# EAGLE design Locomotion_Breakout (EAGLE 7.6.0)
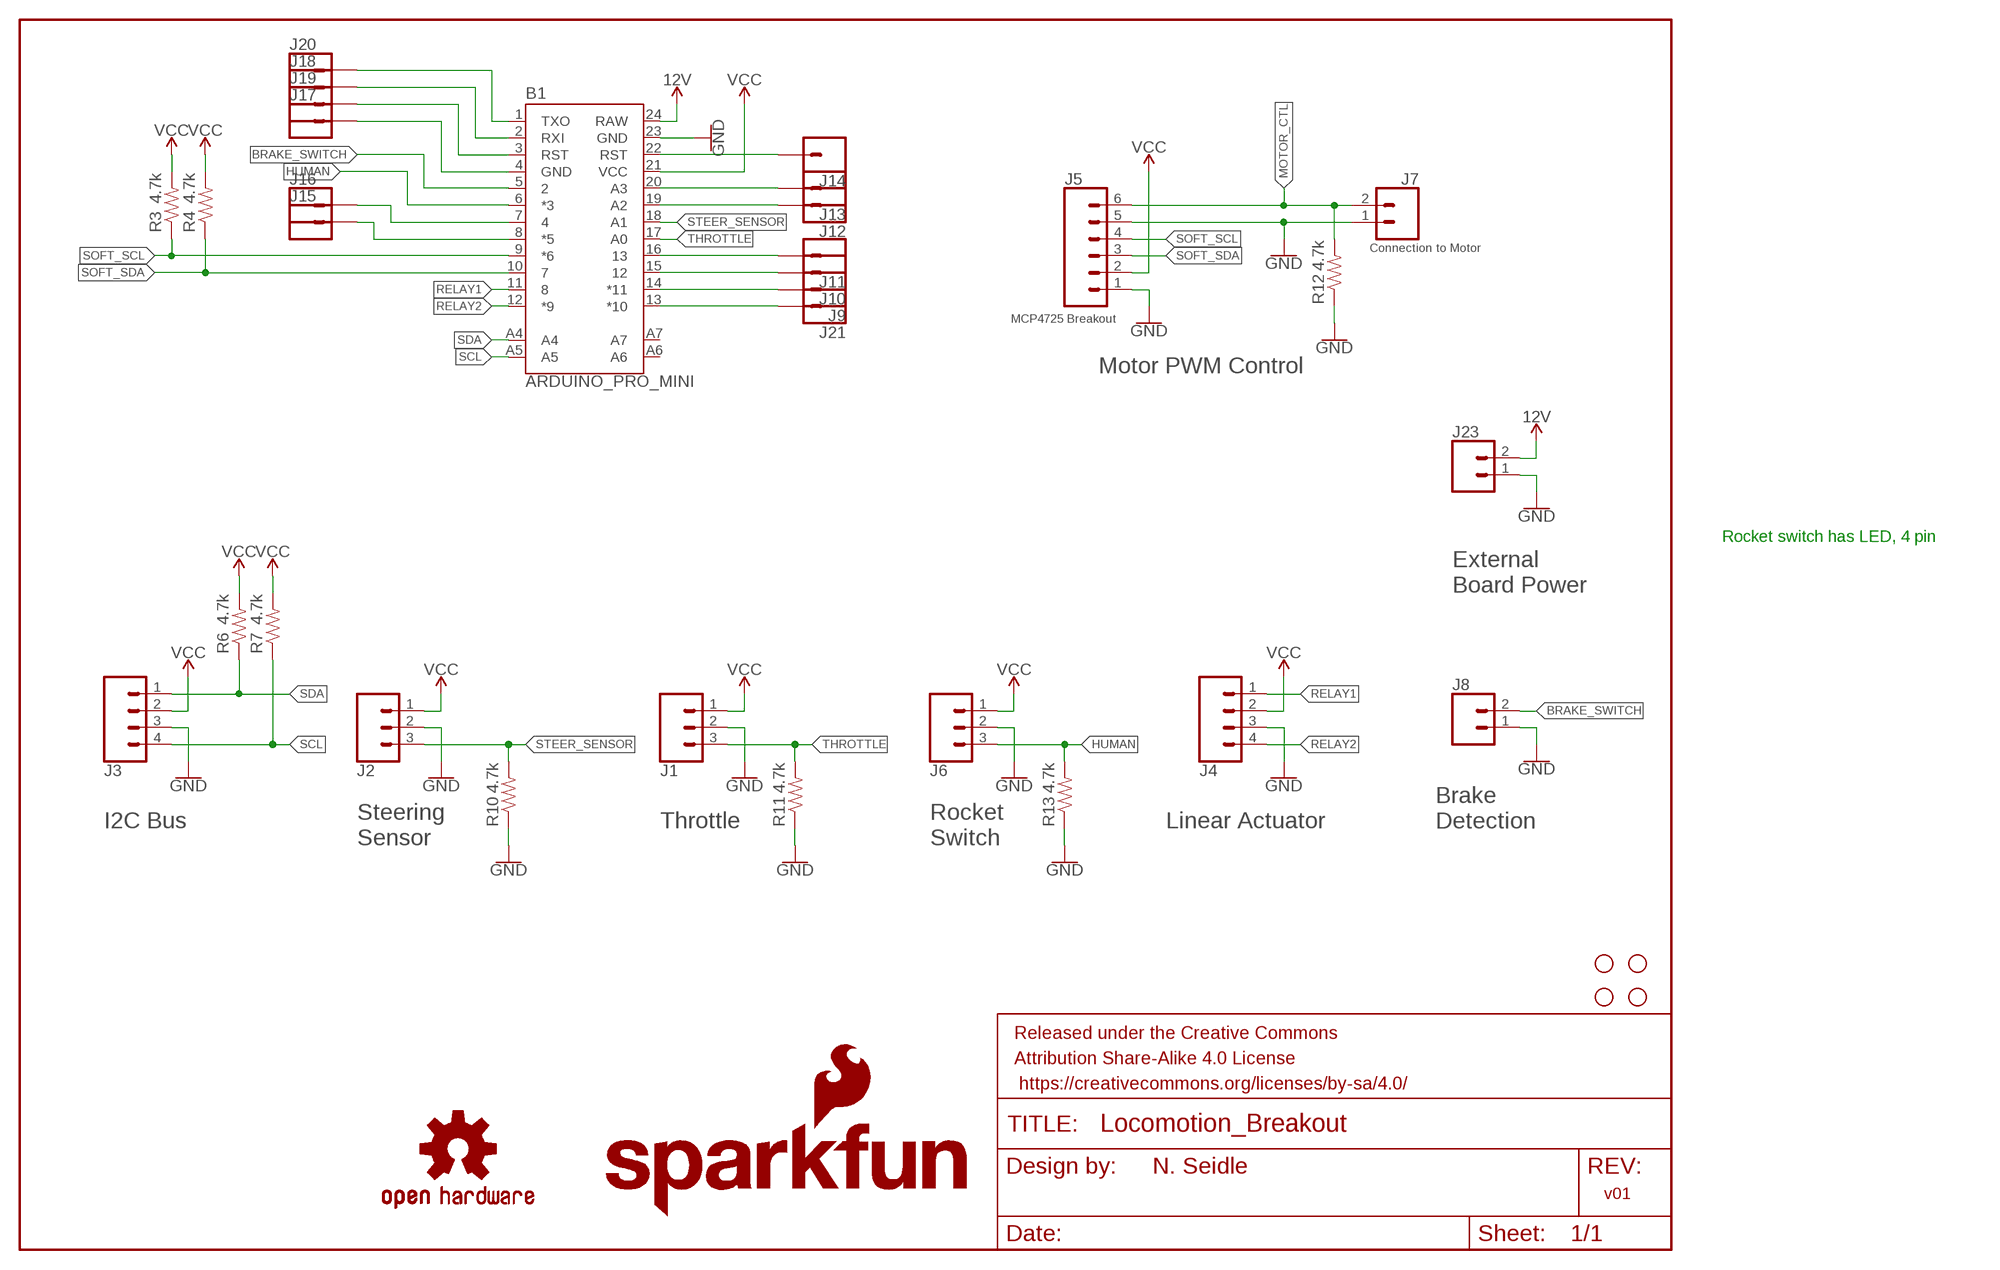
[diagram p0: schematic, sheet 1]

## Parts
B1  ARDUINO_PRO_MINI  [ARDUINO_PRO_MINI]
FRAME1  FRAME-LETTER  [CREATIVE_COMMONS]
J1  CONN_03JST-PTH-VERT  [JST-3-PTH-VERT]
J2  CONN_03JST-PTH-VERT  [JST-3-PTH-VERT]
J3  CONN_04JST-PTH-VERT  [JST-4-PTH-VERT]
J4  CONN_04JST-PTH-VERT  [JST-4-PTH-VERT]
J5  CONN_06SILK_FEMALE_PTH  [1X06]
J6  CONN_03JST-PTH-VERT  [JST-3-PTH-VERT]
J7  CONN_02JST-PTH-VERT  [JST-2-PTH-VERT]
J8  CONN_02JST-PTH-VERT  [JST-2-PTH-VERT]
J9  CONN_01PTH_NO_SILK_YES_STOP  [1X01_NO_SILK]
J10  CONN_01PTH_NO_SILK_YES_STOP  [1X01_NO_SILK]
J11  CONN_01PTH_NO_SILK_YES_STOP  [1X01_NO_SILK]
J12  CONN_01PTH_NO_SILK_YES_STOP  [1X01_NO_SILK]
J13  CONN_01PTH_NO_SILK_YES_STOP  [1X01_NO_SILK]
J14  CONN_01PTH_NO_SILK_YES_STOP  [1X01_NO_SILK]
J15  CONN_01PTH_NO_SILK_YES_STOP  [1X01_NO_SILK]
J16  CONN_01PTH_NO_SILK_YES_STOP  [1X01_NO_SILK]
J17  CONN_01PTH_NO_SILK_YES_STOP  [1X01_NO_SILK]
J18  CONN_01PTH_NO_SILK_YES_STOP  [1X01_NO_SILK]
J19  CONN_01PTH_NO_SILK_YES_STOP  [1X01_NO_SILK]
J20  CONN_01PTH_NO_SILK_YES_STOP  [1X01_NO_SILK]
J21  CONN_01PTH_NO_SILK_YES_STOP  [1X01_NO_SILK]
J23  CONN_02JST-PTH-VERT  [JST-2-PTH-VERT]
LOGO1  SFE_LOGO_FLAME.1_INCH  [SFE_LOGO_FLAME_.1]
LOGO2  OSHW-LOGOS  [OSHW-LOGO-S]
LOGO3  SFE_LOGO_NAME.1_INCH  [SFE_LOGO_NAME_.1]
R3  4.7k  1KOHM-HORIZ-1/4W-5%  [AXIAL-0.3]
R4  4.7k  1KOHM-HORIZ-1/4W-5%  [AXIAL-0.3]
R6  4.7k  1KOHM-HORIZ-1/4W-5%  [AXIAL-0.3]
R7  4.7k  1KOHM-HORIZ-1/4W-5%  [AXIAL-0.3]
R10  4.7k  1KOHM-HORIZ-1/4W-5%  [AXIAL-0.3]
R11  4.7k  1KOHM-HORIZ-1/4W-5%  [AXIAL-0.3]
R12  4.7k  1KOHM-HORIZ-1/4W-5%  [AXIAL-0.3]
R13  4.7k  1KOHM-HORIZ-1/4W-5%  [AXIAL-0.3]
STANDOFF1  STAND-OFF  [STAND-OFF]
STANDOFF2  STAND-OFF  [STAND-OFF]
STANDOFF3  STAND-OFF  [STAND-OFF]
STANDOFF4  STAND-OFF  [STAND-OFF]

## Nets
12V: B1.24(RAW) J23.2
BRAKE_SWITCH: B1.5 J8.2
GND [power]: B1.23(GND) J1.2 J2.2 J3.3 J4.3 J5.1 J5.5 J6.2 J7.1 J8.1 J23.1 R10.P$1 R11.P$1 R12.P$1 R13.P$1
HUMAN: B1.6(*3) J6.3 R13.P$2
MOTOR_CTL: J5.6 J7.2 R12.P$2
N$1: B1.2(RXI) J18.1
N$2: B1.3(RST) J19.1
N$3: B1.4(GND) J17.1
N$4: B1.7 J16.1
N$5: B1.8(*5) J15.1
N$6: B1.13(*10) J21.1
N$7: B1.14(*11) J9.1
N$8: B1.15 J10.1
N$9: B1.16 J11.1
N$10: B1.19(A2) J12.1
N$11: B1.20(A3) J13.1
N$13: B1.22(RST) J14.1
N$14: B1.1(TXO) J20.1
RELAY1: B1.11 J4.1
RELAY2: B1.12(*9) J4.4
SCL: B1.A5 J3.4 R7.P$1
SDA: B1.A4 J3.1 R6.P$1
SOFT_SCL: B1.9(*6) J5.4 R3.P$1
SOFT_SDA: B1.10 J5.3 R4.P$1
STEER_SENSOR: B1.18(A1) J2.3 R10.P$2
THROTTLE: B1.17(A0) J1.3 R11.P$2
VCC: B1.21(VCC) J1.1 J2.1 J3.2 J4.2 J5.2 J6.1 R3.P$2 R4.P$2 R6.P$2 R7.P$2
Unconnected: B1.A6 B1.A7

## Notes on the sheet
- Connection to Motor
- MCP4725 Breakout
- Motor PWM Control
- Rocket switch has LED, 4 pin
- External
  Board Power
- I2C Bus | Throttle | Linear Actuator
- Brake
  Detection
- Steering
  Sensor
- Rocket
  Switch
- N. Seidle
- v01

## Library data of the parts
B1 = SparkFun-Boards:ARDUINO_PRO_MINI: SparkFun Pro Mini Pro Mini compatible footprint. Dimensions: 0.7 x 1.3" PCB Thickness: 0.8mm SparkFun Products: 3.3V/8MHz <https://www.sparkfun.com/products/11114> 5V/16MHz <https://www.sparkfun.com/products/11113>
FRAME1 = SparkFun-Aesthetics:FRAME-LETTER: Schematic Frame Standard 8.5x11 US Letter frame
J1 J2 J6 = SparkFun-Connectors:CONN_03: Multi connection point. Often used as Generic Header-pin footprint for 0.1 inch spaced/style header connections On any of the 0.1 inch spaced packages, you can populate with these: Break Away Headers - Straight <https://www.sparkfun.com/products/116> (PRT-00116) Break Away Male Headers - Right Angle <https://www.sparkfun.com/products/553> (PRT-00553) Female Headers <https://www.sparkfun.com/products/115> (PRT-00115) Break Away Headers - Machine Pin <https://www.sparkfun.com/products/117> (PRT-00117) Break Away Female Headers - Swiss Machine Pin <https://www.sparkfun.com/products/743> (PRT-00743) Stackable Header - 3 Pin (Female, 0.1") <https://www.sparkfun.com/products/13875> (PRT-13875) For SCREWTERMINALS and SPRING TERMINALS visit here: Screw Terimnals on SparkFun.com <https://www.sparkfun.com/search/results?term=Screw+Terminals> (5mm/3.5mm/2.54mm spacing) This device is also useful as a general connection point to wire up your design to another part of your project. Our various solder wires solder well into these plated through hole pads. Hook-Up Wire - Assortment (Stranded, 22 AWG) <https://www.sparkfun.com/products/11375> (PRT-11375) Hook-Up Wire - Assortment (Solid Core, 22 AWG) <https://www.sparkfun.com/products/11367> (PRT-11367) View the entire wire category on our website here <https://www.sparkfun.com/categories/141> Special notes: Molex polarized connector foot print use with SKU : PRT-08232 with associated crimp pins and housings.
J3 J4 = SparkFun-Connectors:CONN_04: Multi connection point. Often used as Generic Header-pin footprint for 0.1 inch spaced/style header connections On any of the 0.1 inch spaced packages, you can populate with these: Break Away Headers - Straight <https://www.sparkfun.com/products/116> (PRT-00116) Break Away Male Headers - Right Angle <https://www.sparkfun.com/products/553> (PRT-00553) Female Headers <https://www.sparkfun.com/products/115> (PRT-00115) Break Away Headers - Machine Pin <https://www.sparkfun.com/products/117> (PRT-00117) Break Away Female Headers - Swiss Machine Pin <https://www.sparkfun.com/products/743> (PRT-00743) For SCREWTERMINALS and SPRING TERMINALS visit here: Screw Terimnals on SparkFun.com <https://www.sparkfun.com/search/results?term=Screw+Terminals> (5mm/3.5mm/2.54mm spacing) This device is also useful as a general connection point to wire up your design to another part of your project. Our various solder wires solder well into these plated through hole pads. Hook-Up Wire - Assortment (Stranded, 22 AWG) <https://www.sparkfun.com/products/11375> (PRT-11375) Hook-Up Wire - Assortment (Solid Core, 22 AWG) <https://www.sparkfun.com/products/11367> (PRT-11367) View the entire wire category on our website here <https://www.sparkfun.com/categories/141> Special notes: Molex polarized connector foot print use with SKU : PRT-08231 with associated crimp pins and housings. 1MM SMD Version SKU: PRT-10208; PROD_ID: CONN-13251
J5 = SparkFun-Connectors:CONN_06: Multi connection point. Often used as Generic Header-pin footprint for 0.1 inch spaced/style header connections On any of the 0.1 inch spaced packages, you can populate with these: Break Away Headers - Straight <https://www.sparkfun.com/products/116> (PRT-00116) Break Away Male Headers - Right Angle <https://www.sparkfun.com/products/553> (PRT-00553) Female Headers <https://www.sparkfun.com/products/115> (PRT-00115) Break Away Headers - Machine Pin <https://www.sparkfun.com/products/117> (PRT-00117) Break Away Female Headers - Swiss Machine Pin <https://www.sparkfun.com/products/743> (PRT-00743) Arduino Stackable Header - 6 Pin <https://www.sparkfun.com/products/9280> (PRT-09280) For SCREWTERMINALS and SPRING TERMINALS visit here: Screw Terimnals on SparkFun.com <https://www.sparkfun.com/search/results?term=Screw+Terminals> (5mm/3.5mm/2.54mm spacing) This device is also useful as a general connection point to wire up your design to another part of your project. Our various solder wires solder well into these plated through hole pads. Hook-Up Wire - Assortment (Stranded, 22 AWG) <https://www.sparkfun.com/products/11375> (PRT-11375) Hook-Up Wire - Assortment (Solid Core, 22 AWG) <https://www.sparkfun.com/products/11367> (PRT-11367) View the entire wire category on our website here <https://www.sparkfun.com/categories/141> Special notes: Molex polarized connector foot print use with SKU : PRT-08231 with associated crimp pins and housings. 1MM SMD Version SKU: PRT-10208 NOTES ON THE VARIANTS LOCK and LOCK_LONGPADS... This footprint was designed to help hold the alignment of a through-hole component (i.e. 6-pin header) while soldering it into place. You may notice that each hole has been shifted either up or down by 0.005 of an inch from it's more standard position (which is a perfectly straight line). This slight alteration caused the pins (the squares in the middle) to touch the edges of the holes. Because they are alternating, it causes a "brace" to hold the component in place. 0.005 has proven to be the perfect amount of "off-center" position when using our standard breakaway headers. Although looks a little odd when you look at the bare footprint, once you have a header in there, the alteration is very hard to notice. Also,if you push a header all the way into place, it is covered up entirely on the bottom side.; PROD_ID: CONN-08437
J7 J8 J23 = SparkFun-Connectors:CONN_02: Multi connection point. Often used as Generic Header-pin footprint for 0.1 inch spaced/style header connections On any of the 0.1 inch spaced packages, you can populate with these: Break Away Headers - Straight <https://www.sparkfun.com/products/116> (PRT-00116) Break Away Male Headers - Right Angle <https://www.sparkfun.com/products/553> (PRT-00553) Female Headers <https://www.sparkfun.com/products/115> (PRT-00115) Break Away Headers - Machine Pin <https://www.sparkfun.com/products/117> (PRT-00117) Break Away Female Headers - Swiss Machine Pin <https://www.sparkfun.com/products/743> (PRT-00743) For SCREWTERMINALS and SPRING TERMINALS visit here: Screw Terimnals on SparkFun.com <https://www.sparkfun.com/search/results?term=Screw+Terminals> (5mm/3.5mm/2.54mm spacing) This device is also useful as a general connection point to wire up your design to another part of your project. Our various solder wires solder well into these plated through hole pads. Hook-Up Wire - Assortment (Stranded, 22 AWG) <https://www.sparkfun.com/products/11375> (PRT-11375) Hook-Up Wire - Assortment (Solid Core, 22 AWG) <https://www.sparkfun.com/products/11367> (PRT-11367) View the entire wire category on our website here <https://www.sparkfun.com/categories/141> Special notes: Molex polarized connector foot print use with: PRT-08233 with associated crimp pins and housings. 2.54_SCREWTERM for use with PRT-10571. 3.5mm Screw Terminal footprints for PRT-08084 5mm Screw Terminal footprints for use with PRT-08432
J9-J21 = SparkFun-Connectors:CONN_01: Single connection point. Often used as Generic Header-pin footprint for 0.1 inch spaced/style header connections On any of the 0.1 inch spaced packages, you can populate with these: Break Away Headers - Straight <https://www.sparkfun.com/products/116> (PRT-00116) Break Away Male Headers - Right Angle <https://www.sparkfun.com/products/553> (PRT-00553) Female Headers <https://www.sparkfun.com/products/115> (PRT-00115) Break Away Headers - Machine Pin <https://www.sparkfun.com/products/117> (PRT-00117) Break Away Female Headers - Swiss Machine Pin <https://www.sparkfun.com/products/743> (PRT-00743) This device is also useful as a general connection point to wire up your design to another part of your project. Our various solder wires solder well into these plated through hole pads. Hook-Up Wire - Assortment (Stranded, 22 AWG) <https://www.sparkfun.com/products/11375> (PRT-11375) Hook-Up Wire - Assortment (Solid Core, 22 AWG) <https://www.sparkfun.com/products/11367> (PRT-11367) View the entire wire category on our website here <https://www.sparkfun.com/categories/141> Special notes: SMTSO-256-ET is a "flush mount" nut for a 4-40 screw. We mostly use this on specialty testbeds; it is a nice way to connect hardware to your PCB at an adjustable hieght. Also note, the SNAP packages are for using a snappable style connector. We sell a baggie of snaps and they are also used on two LilyPad designs: Snap Assortment - 30 pack (male and female) <https://www.sparkfun.com/products/11347> (DEV-11347) LilyPad Arduino SimpleSnap <https://www.sparkfun.com/products/10941> (DEV-10941) LilyPad SimpleSnap Protoboard <https://www.sparkfun.com/products/10940> (DEV-10940)
LOGO1 = SparkFun-Aesthetics:SFE_LOGO_FLAME: SparkFun Flame Logo This is the SparkFun flame logo. The logo on the schematic will always be the same size; the package variant is the height of the flame. Default layer for the logo on the board is tSilk.
LOGO2 = SparkFun-Aesthetics:OSHW-LOGO: Open Source Hardware Logo This logo indicates the piece of hardware it is found on incorporates a OSHW license and/or adheres to the definition of open source hardware found here: http://freedomdefined.org/OSHW
LOGO3 = SparkFun-Aesthetics:SFE_LOGO_NAME: SparkFun Font Logo This is the SparkFun name logo. The logo on the schematic will always be the same size; the package variant is the height of the flame part of the logo (or the height the flame would be, if it were drawn). Default layer for the logo on the board is tSilk.
R3 R4 R6 R7 R10-R13 = SparkFun-Resistors:1KOHM: 1kΩ resistor A resistor is a passive two-terminal electrical component that implements electrical resistance as a circuit element. Resistors act to reduce current flow, and, at the same time, act to lower voltage levels within circuits. - Wikipedia; PROD_ID: RES-08380; VALUE: 1k
STANDOFF1-STANDOFF4 = SparkFun-Electromechanical:STAND-OFF: #4 Stand Off This is the mechanical footprint for a #4 phillips button head screw. Use the keepout ring to avoid running the screw head into surrounding components. SKU : PRT-00447

## Net classes
1 power: width 0.203 mm

## Board
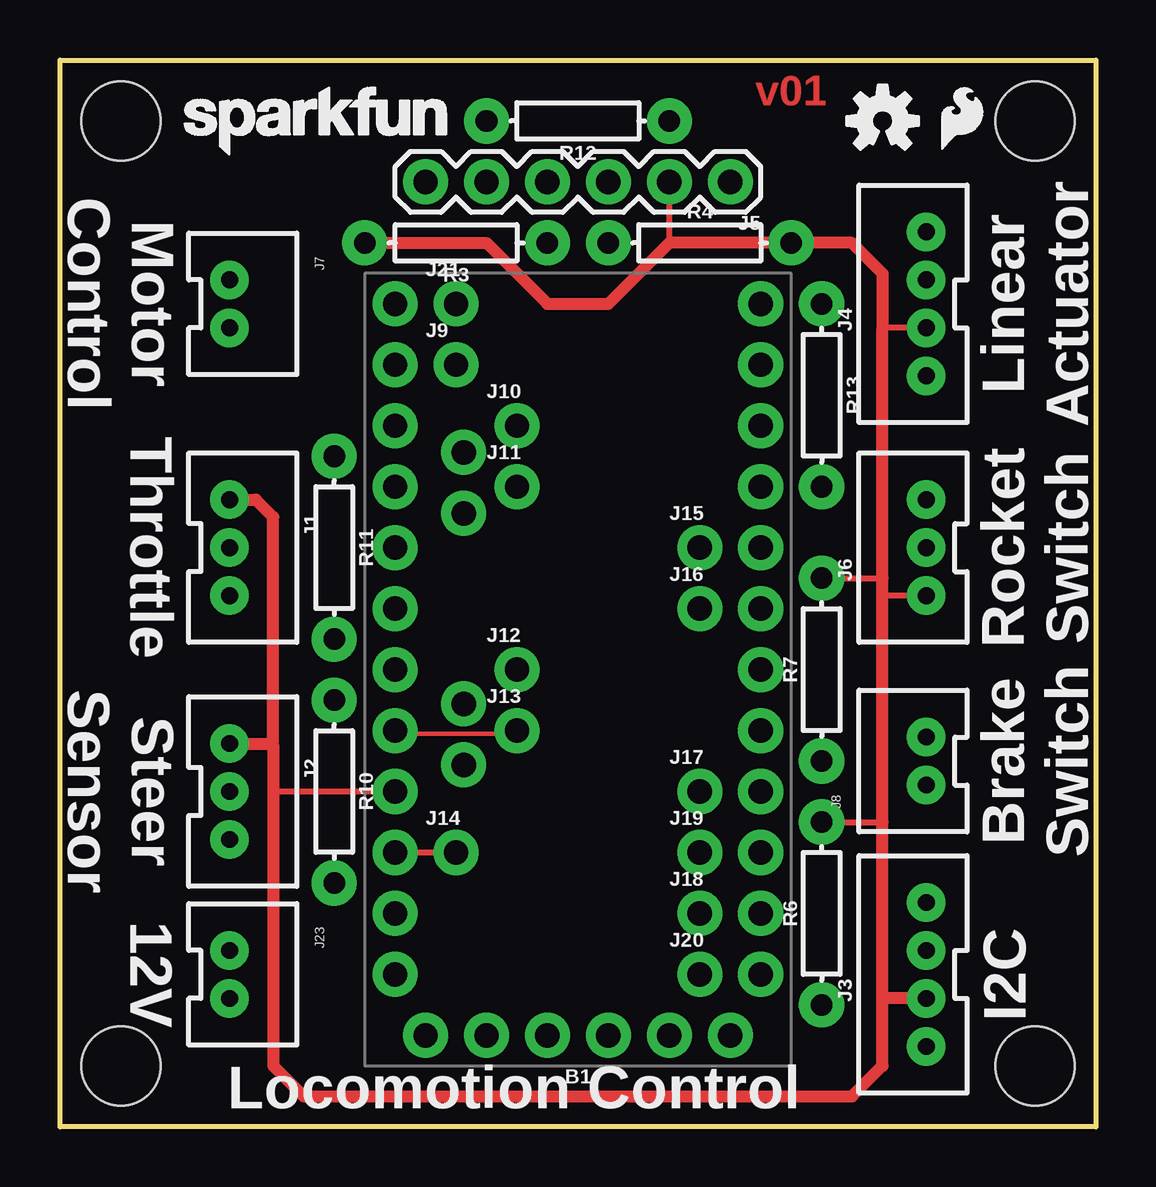
[diagram p1: board, top side]
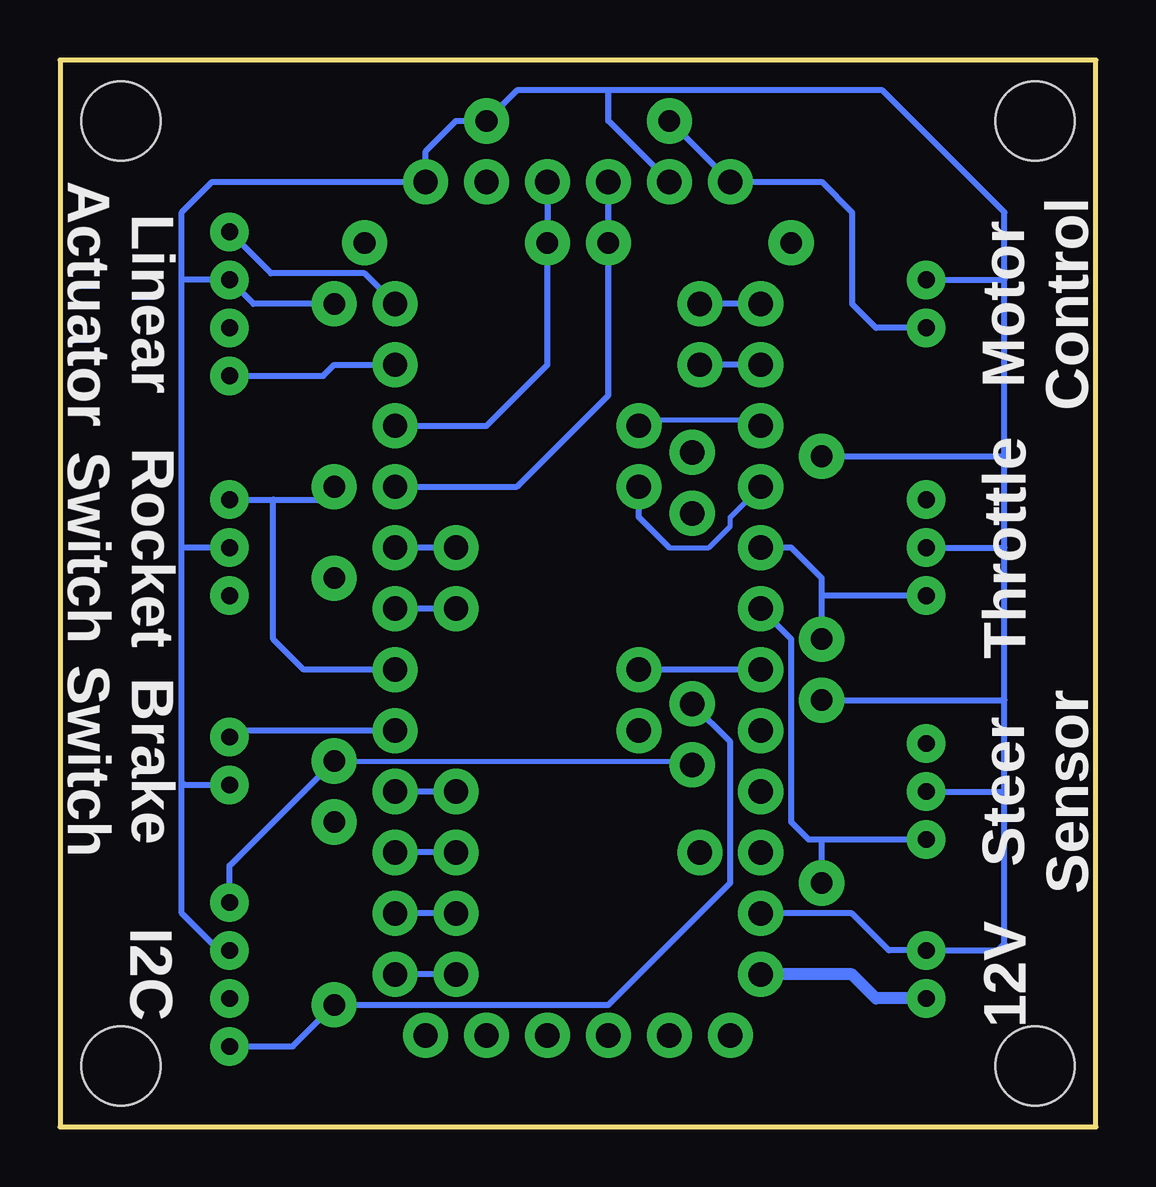
[diagram p2: board, bottom side, seen from below]

Size 43.18 x 44.45 mm. Coordinates in mm from the lower left corner, seen from the top.
Outline: 43.18,0 0,0 0,44.45 43.18,44.45 43.18,0
Copper layers (1*16): Top 0.035mm / dielectric 1.5mm / Bottom 0.035mm
Design rules "SparkFun-2-layer-TIGHT": minimum track width 7mil, minimum drill 15mil, track to track 7mil, track to pad 7mil, pad to pad 7mil, via to via 7mil, smd to smd 7mil, copper to edge 7mil, drill to drill 7mil, minimum pad ring 7mil, minimum via ring 7mil, stop-mask expansion 4mil, vias tented up to drill 20mil, thermal gap 10mil

### Footprints (pad centres in the part's own frame; a part is rotated, then mirrored left to right if it is on the bottom)
ARDUINO_PRO_MINI = drill 1.016 pad 1.88: 1 -7.62,12.7; 2 -7.62,10.16; 3 -7.62,7.62; 4 -7.62,5.08; 5 -7.62,2.54; 6 -7.62,0; 7 -7.62,-2.54; 8 -7.62,-5.08; 9 -7.62,-7.62; 10 -7.62,-10.16; 11 -7.62,-12.7; 12 -7.62,-15.24; 13 7.62,-15.24; 14 7.62,-12.7; 15 7.62,-10.16; 16 7.62,-7.62; 17 7.62,-5.08; 18 7.62,-2.54; 19 7.62,0; 20 7.62,2.54; 21 7.62,5.08; 22 7.62,7.62; 23 7.62,10.16; 24 7.62,12.7; A4 4.763,1.429; A5 4.763,3.969; A6 4.763,-9.049; A7 4.763,-6.509; BLK -6.35,15.24; GND -3.81,15.24; GRN 6.35,15.24; RXI 1.27,15.24; TXO 3.81,15.24; VCC -1.27,15.24
JST-3-PTH-VERT = drill 0.7 pad 1.6: 1 -2,-0.55; 2 0,-0.55; 3 2,-0.55
JST-4-PTH-VERT = drill 0.7 pad 1.6: 1 -3,-0.55; 2 -1,-0.55; 3 1,-0.55; 4 3,-0.55
1X06 = drill 1.016 pad 1.88: 1 0,0; 2 2.54,0; 3 5.08,0; 4 7.62,0; 5 10.16,0; 6 12.7,0
JST-2-PTH-VERT = drill 0.7 pad 1.6: 1 -1,-0.55; 2 1,-0.55
1X01_NO_SILK = drill 1.016 pad 1.88: 1 0,0
AXIAL-0.3 = drill 0.9 pad 1.88: P$1 -3.81,0; P$2 3.81,0
STAND-OFF = hole 3.302: 0,0

### Placement (x,y rotation side)
B1  21.59,19.05 180 top
FRAME1  -2.54,-16.51 0 top  (outside the outline)
J1  7.62,24.13 270 top
J2  7.62,13.97 270 top
J3  35.56,6.35 90 top
J4  35.56,34.29 90 top
J5  27.94,39.37 180 top
J6  35.56,24.13 90 top
J7  7.62,34.29 270 top
J8  35.56,15.24 90 top
J9  16.51,31.75 0 top
J10  19.05,29.21 0 top
J11  19.05,26.67 0 top
J12  19.05,19.05 0 top
J13  19.05,16.51 0 top
J14  16.51,11.43 0 top
J15  26.67,24.13 0 top
J16  26.67,21.59 0 top
J17  26.67,13.97 0 top
J18  26.67,8.89 0 top
J19  26.67,11.43 0 top
J20  26.67,6.35 0 top
J21  16.51,34.29 0 top
J23  7.62,6.35 270 top
LOGO1  36.45,40.39 0 top
LOGO2  34.29,41.91 0 top
LOGO3  4.7,40.01 0 top
R3  16.51,36.83 180 top
R4  26.67,36.83 0 top
R6  31.75,8.89 90 top
R7  31.75,19.05 90 top
R10  11.43,13.97 270 top
R11  11.43,24.13 270 top
R12  21.59,41.91 180 top
R13  31.75,30.48 270 top
STANDOFF1  2.54,2.54 0 top
STANDOFF2  2.54,41.91 0 top
STANDOFF3  40.64,41.91 0 top
STANDOFF4  40.64,2.54 0 top

### Tracks (layer width: path | path; a pad name or v marks a point on that pad's centre or on a via)
12V
  Bottom 0.508: J23.2 9.16,5.35 10.16,6.35 B1.24
BRAKE_SWITCH
  Bottom 0.254: B1.5 35.84,16.51 J8.2
GND
  Bottom 0.254: J3.3 36.56,7.35 38.1,8.89 38.1,14.35 | 38.1,14.35 38.1,24.13 | 38.1,24.13 38.1,35.31 | 38.1,35.31 38.1,38.1 36.83,39.37 J5.1 27.94,40.64 26.67,41.91 R12.P$1 24.13,43.18 20.32,43.18 | R13.P$1 35.11,34.29 J4.3 38.08,35.29 38.1,35.31 | J8.1 37.99,14.24 38.1,14.35 | 3.81,13.97 3.81,7.62 4.08,7.35 J23.1 8.62,7.35 10.16,8.89 B1.23 | 3.81,13.97 3.81,17.78 | 3.81,17.78 3.81,24.13 | 3.81,24.13 3.81,27.94 | 3.81,27.94 3.81,35.31 | 3.81,35.31 3.81,38.1 8.89,43.18 20.32,43.18 | R11.P$1 3.81,27.94 | J1.2 3.81,24.13 | R10.P$1 3.81,17.78 | J2.2 3.81,13.97 | J6.2 38.1,24.13 | J7.1 3.83,35.29 3.81,35.31 | J5.5 20.32,41.91 20.32,43.18
HUMAN
  Bottom 0.254: B1.6 33.02,19.05 34.29,20.32 34.29,26.13 | J6.3 34.29,26.13 | 34.29,26.13 32.29,26.13 R13.P$2
MOTOR_CTL
  Bottom 0.254: R12.P$2 J5.6 11.43,39.37 10.16,38.1 10.16,34.29 9.16,33.29 J7.2
N$1
  Bottom 0.254: J18.1 B1.2
N$2
  Bottom 0.254: J19.1 B1.3
N$3
  Bottom 0.254: J17.1 B1.4
N$4
  Bottom 0.254: J16.1 B1.7
N$5
  Bottom 0.254: J15.1 B1.8
N$6
  Bottom 0.254: B1.13 J21.1
N$7
  Bottom 0.254: B1.14 J9.1
N$8
  Bottom 0.203: 18.8,29.46 14.22,29.46 B1.15
  Bottom 0.254: 18.8,29.46 J10.1
N$9
  Bottom 0.203: 17.78,24.13 16.13,24.13 15.24,25.02 15.24,25.4 B1.16
  Bottom 0.254: 17.78,24.13 19.05,25.4 J11.1
N$10
  Bottom 0.254: B1.19 J12.1
N$11
  Top 0.178: 18.92,16.38 14.1,16.38 B1.20
  Top 0.254: 18.92,16.38 J13.1
N$13
  Top 0.254: B1.22 J14.1
N$14
  Bottom 0.254: J20.1 B1.1
RELAY1
  Bottom 0.254: J4.1 32.21,31.29 31.75,31.75 B1.11
RELAY2
  Bottom 0.254: B1.12 30.48,35.56 34.38,35.56 J4.4
SCL
  Bottom 0.203: R7.P$1 16.99,15.24 B1.A5
  Bottom 0.254: R7.P$1 36.11,10.88 J3.4
SDA
  Bottom 0.254: J3.1 33.48,3.35 R6.P$1 20.32,5.08 15.24,10.16 15.24,16.03 B1.A4
SOFT_SCL
  Bottom 0.254: B1.9 24.13,26.67 20.32,30.48 R3.P$1 J5.4
SOFT_SDA
  Bottom 0.254: B1.10 25.4,29.21 22.86,31.75 R4.P$1 J5.3
STEER_SENSOR
  Bottom 0.254: B1.18 12.7,20.32 12.7,12.7 11.97,11.97 11.43,11.97 | J2.3 11.43,11.97 | R10.P$2 11.43,11.97
THROTTLE
  Bottom 0.254: J1.3 11.4,22.13 11.43,22.1 | R11.P$2 11.43,22.1 | 11.43,22.1 11.43,22.86 12.7,24.13 B1.17
VCC
  Top 0.254: 25.4,36.83 J5.2 | R6.P$2 34.29,12.7 | R7.P$2 34.29,22.86 34.32,22.83 34.32,22.13 | J6.1 34.32,22.13 | 34.32,22.13 34.29,22.1 | J4.2 34.31,33.29 34.29,33.27 | 8.79,15.97 8.89,15.88 | B1.21 8.89,13.97
  Top 0.508: J2.1 8.79,15.97 | 34.29,5.46 34.29,2.54 33.02,1.27 10.16,1.27 8.89,2.54 8.89,13.97 8.89,15.88 8.89,25.4 8.16,26.13 J1.1 | 34.29,5.46 34.29,12.7 34.29,22.1 34.29,22.86 34.29,33.27 34.29,35.56 33.02,36.83 R4.P$2 25.4,36.83 22.86,34.29 20.32,34.29 17.78,36.83 R3.P$2 | J3.2 34.4,5.35 34.29,5.46

### Text on the board
Top: v01
tPlace: Motor / Control | Linear / Actuator | Throttle | Rocket / Switch | Brake / Switch | Steer / Sensor | 12V | I2C | Locomotion Control
bPlace: Motor / Control | Linear / Actuator | Throttle | Rocket / Switch | Brake / Switch | Steer / Sensor | 12V | I2C
Measures: Clears 4-40 Screw | All Dimensions in Inches
tDocu: N. Seidle